# EAGLE board ArduHub (EAGLE 7.3.0)
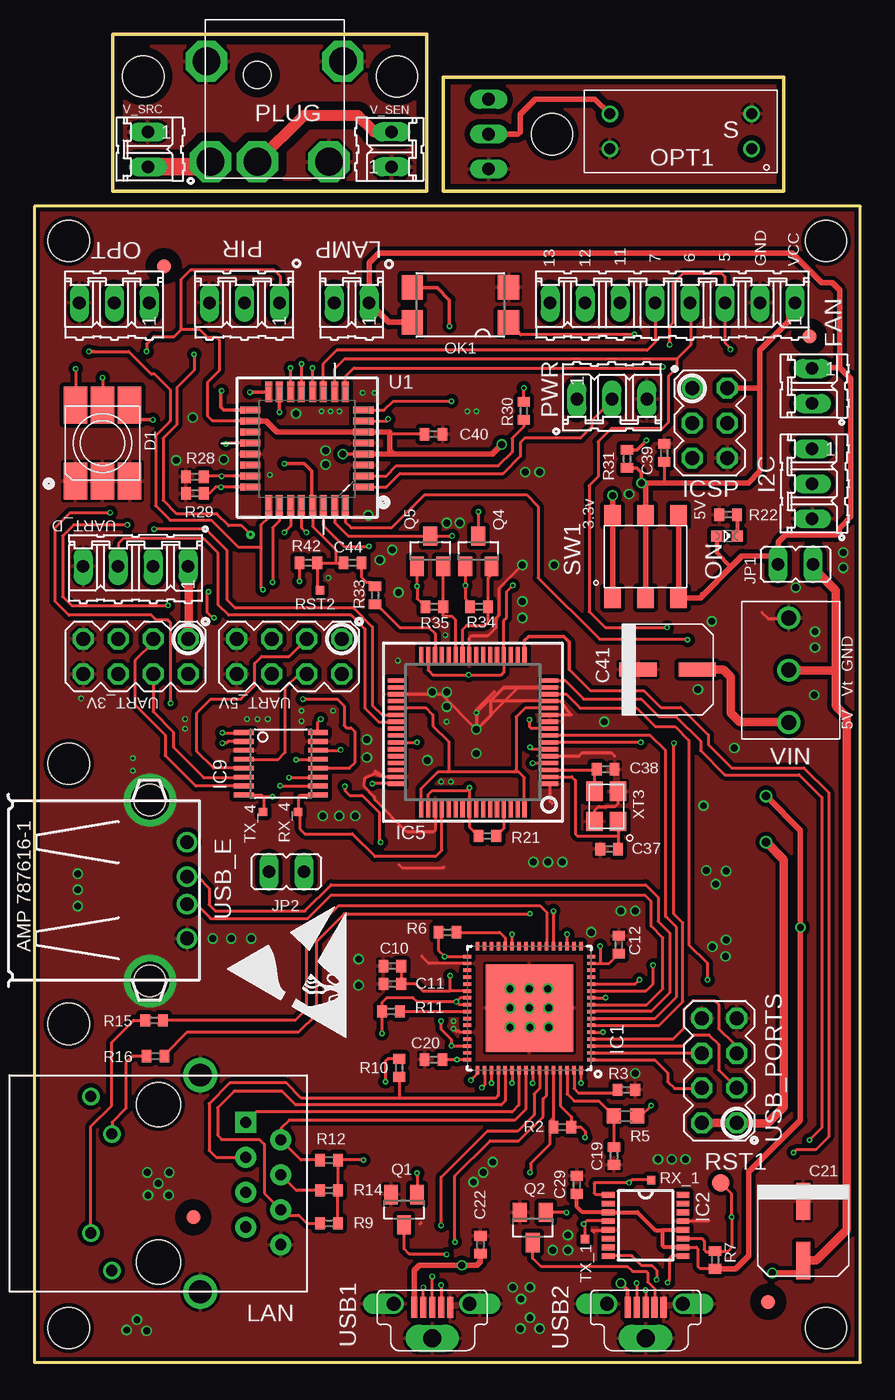
[diagram p3: board, top side]
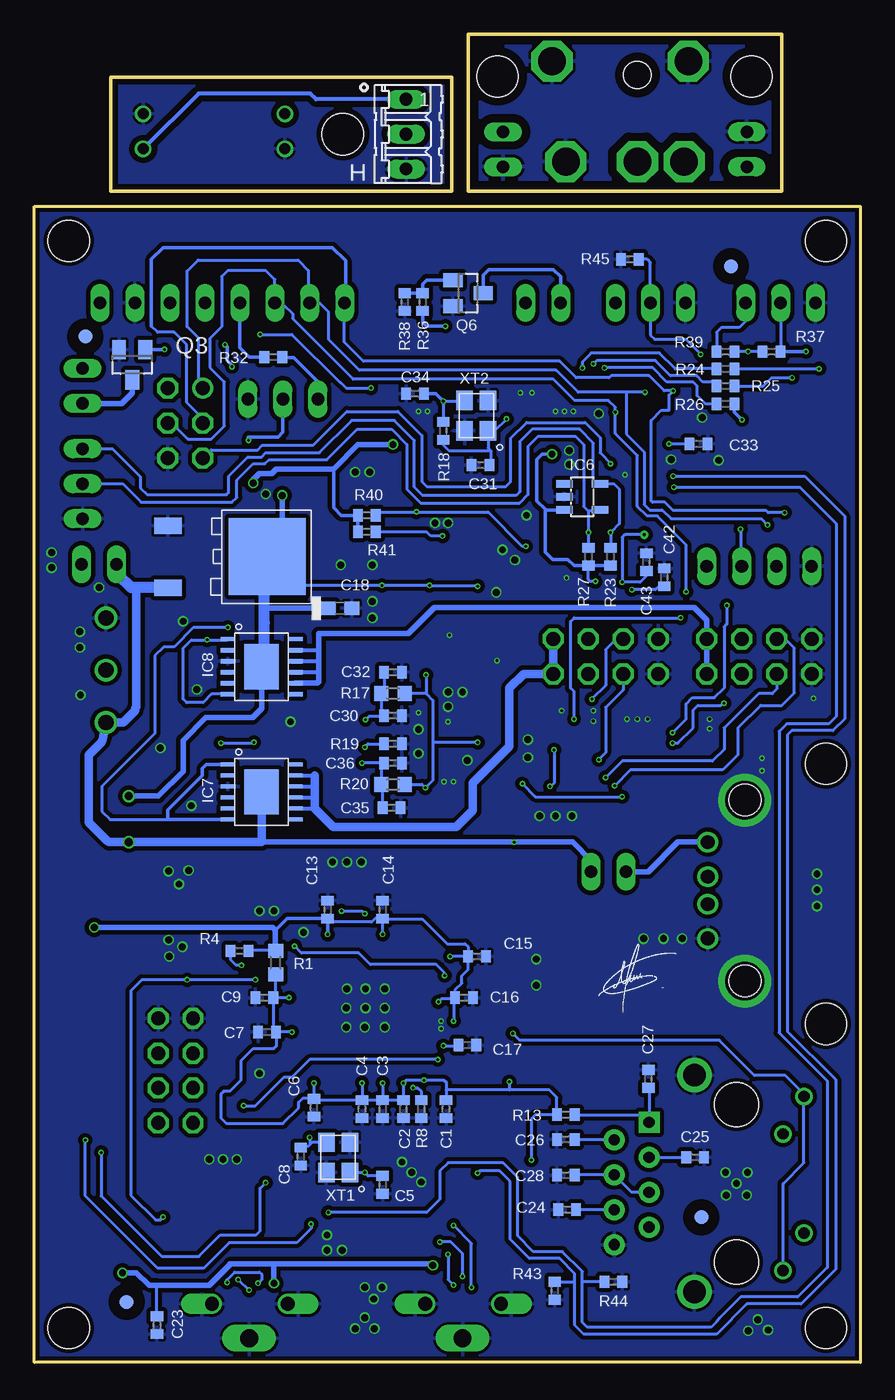
[diagram p4: board, bottom side, seen from below]

Size 60 x 96.5 mm. Coordinates in mm from the lower left corner, seen from the top.
Outline: 0,84 0,0 60,0 60,84 0,84
Outline: 5.7,96.5 5.7,85.1 28.5,85.1 28.5,96.5 5.7,96.5
Outline: 29.7,93.4 29.7,85.1 54.45,85.1 54.45,93.4 29.7,93.4
Copper layers (1*16): Top 0.035mm / dielectric 1.5mm / Bottom 0.035mm
Design rules "default *": minimum track width 0.2mm, minimum drill 0.2mm, track to track 0.2mm, track to pad 0.2mm, pad to pad 0.2mm, via to via 0.2mm, smd to smd 0.2mm, copper to edge 0.2mm, drill to drill 0.2mm, minimum pad ring 0.1mm, minimum via ring 0.1mm, stop-mask expansion 0.2mm, vias tented up to drill 0mil, thermal gap 0.2mm
Holes 3 mm at 2.5,24.6 2.5,2.5 2.5,43.5 57.5,2.5 2.5,81.5 57.5,81.5 37.6,89.25 7.9,93.45 26.35,93.45

## Footprints (pad centres in the part's own frame; a part is rotated, then mirrored left to right if it is on the bottom)
C0402 = smd 0.7 x 0.9: 1 -0.65,0; 2 0.65,0
C0603 = smd 1.1 x 1: 1 -0.85,0; 2 0.85,0
MVA_CAP_F55 = smd 1 x 2.7: P$+ 0,2.15; P$- 0,-2.15
PLCC-6 = smd 2.7 x 1.7: 1 -2.75,1.97; 2 -2.75,0.01; 3 -2.75,-1.97; 4 2.75,-1.97; 5 2.75,0; 6 2.75,1.97
02P = drill 0.914 long: 1 -1.27,0; 2 1.27,0
FIDUCIAL_TEST_2C = smd 1 x 1: P$1 0,0 | smd 1 x 1 bottom: P$2 0,0
03P = drill 0.914 long: 1 -2.54,0; 2 0,0; 3 2.54,0
QFN64 = smd 0.6 x 0.25: 1 -4.5,3.75; 2 -4.5,3.25; 3 -4.5,2.75; 4 -4.5,2.25; 5 -4.5,1.75; 6 -4.5,1.25; 7 -4.5,0.75; 8 -4.5,0.25; 9 -4.5,-0.25; 10 -4.5,-0.75; 11 -4.5,-1.25; 12 -4.5,-1.75; 13 -4.5,-2.25; 14 -4.5,-2.75; 15 -4.5,-3.25; 16 -4.5,-3.75; 33 4.5,-3.75; 34 4.5,-3.25; 35 4.5,-2.75; 36 4.5,-2.25; 37 4.5,-1.75; 38 4.5,-1.25; 39 4.5,-0.75; 40 4.5,-0.25; 41 4.5,0.25; 42 4.5,0.75; 43 4.5,1.25; 44 4.5,1.75; 45 4.5,2.25; 46 4.5,2.75; 47 4.5,3.25; 48 4.5,3.75 | smd 0.25 x 0.6: 17 -3.75,-4.5; 18 -3.25,-4.5; 19 -2.75,-4.5; 20 -2.25,-4.5; 21 -1.75,-4.5; 22 -1.25,-4.5; 23 -0.75,-4.5; 24 -0.25,-4.5; 25 0.25,-4.5; 26 0.75,-4.5; 27 1.25,-4.5; 28 1.75,-4.5; 29 2.25,-4.5; 30 2.75,-4.5; 31 3.25,-4.5; 32 3.75,-4.5; 49 3.75,4.5; 50 3.25,4.5; 51 2.75,4.5; 52 2.25,4.5; 53 1.75,4.5; 54 1.25,4.5; 55 0.75,4.5; 56 0.25,4.5; 57 -0.25,4.5; 58 -0.75,4.5; 59 -1.25,4.5; 60 -1.75,4.5; 61 -2.25,4.5; 62 -2.75,4.5; 63 -3.25,4.5; 64 -3.75,4.5 | smd 6.35 x 6.35: GND 0,0
SSOP16 = smd 0.914 x 0.406: 1 -2.718,2.223; 2 -2.718,1.587; 3 -2.718,0.953; 4 -2.718,0.318; 5 -2.718,-0.318; 6 -2.718,-0.953; 7 -2.718,-1.587; 8 -2.718,-2.223; 9 2.718,-2.223; 10 2.718,-1.587; 11 2.718,-0.953; 12 2.718,-0.318; 13 2.718,0.318; 14 2.718,0.953; 15 2.718,1.587; 16 2.718,2.223
TO_252_3 = smd 1.2 x 2: 1 -2.25,0; 3 2.25,0 | smd 5.6 x 5.6: TAB 0,7.2
LQFP64 = smd 0.3 x 1.2: 1 -3.75,-5.6; 2 -3.25,-5.6; 3 -2.75,-5.6; 4 -2.25,-5.6; 5 -1.75,-5.6; 6 -1.25,-5.6; 7 -0.75,-5.6; 8 -0.25,-5.6; 9 0.25,-5.6; 10 0.75,-5.6; 11 1.25,-5.6; 12 1.75,-5.6; 13 2.25,-5.6; 14 2.75,-5.6; 15 3.25,-5.6; 16 3.75,-5.6; 33 3.75,5.6; 34 3.25,5.6; 35 2.75,5.6; 36 2.25,5.6; 37 1.75,5.6; 38 1.25,5.6; 39 0.75,5.6; 40 0.25,5.6; 41 -0.25,5.6; 42 -0.75,5.6; 43 -1.25,5.6; 44 -1.75,5.6; 45 -2.25,5.6; 46 -2.75,5.6; 47 -3.25,5.6; 48 -3.75,5.6 | smd 1.2 x 0.3: 17 5.6,-3.75; 18 5.6,-3.25; 19 5.6,-2.75; 20 5.6,-2.25; 21 5.6,-1.75; 22 5.6,-1.25; 23 5.6,-0.75; 24 5.6,-0.25; 25 5.6,0.25; 26 5.6,0.75; 27 5.6,1.25; 28 5.6,1.75; 29 5.6,2.25; 30 5.6,2.75; 31 5.6,3.25; 32 5.6,3.75; 49 -5.6,3.75; 50 -5.6,3.25; 51 -5.6,2.75; 52 -5.6,2.25; 53 -5.6,1.75; 54 -5.6,1.25; 55 -5.6,0.75; 56 -5.6,0.25; 57 -5.6,-0.25; 58 -5.6,-0.75; 59 -5.6,-1.25; 60 -5.6,-1.75; 61 -5.6,-2.25; 62 -5.6,-2.75; 63 -5.6,-3.25; 64 -5.6,-3.75
SOT-23-5 = smd 0.55 x 1.2: 1 -0.95,-1.3; 2 0,-1.3; 3 0.95,-1.3; 4 0.95,1.3; 5 -0.95,1.3
POWERSSO-12 = smd 0.3 x 1.05: 1 -2,-2.45; 2 -1.2,-2.45; 3 -0.4,-2.45; 4 0.4,-2.45; 5 1.2,-2.45; 6 2,-2.45; 7 2,2.45; 8 1.2,2.45; 9 0.4,2.45; 10 -0.4,2.45; 11 -1.2,2.45; 12 -2,2.45 | smd 3.3 x 2.5: TAB 0,0
TSSOP-16 = smd 0.35 x 1.43: 1 -2.275,-2.7; 2 -1.625,-2.7; 3 -0.975,-2.7; 4 -0.325,-2.7; 5 0.325,-2.7; 6 0.975,-2.7; 7 1.625,-2.7; 8 2.275,-2.7; 9 2.275,2.7; 10 1.625,2.7; 11 0.975,2.7; 12 0.325,2.7; 13 -0.325,2.7; 14 -0.975,2.7; 15 -1.625,2.7; 16 -2.275,2.7
MA03-2 = drill 1.016: 1 -2.54,-1.27 | drill 1.016 octagon: 2 -2.54,1.27; 3 0,-1.27; 4 0,1.27; 5 2.54,-1.27; 6 2.54,1.27
JP1 = drill 0.914 long: 1 0,-1.27; 2 0,1.27
J0011D01BNL = drill 0.813 pad 1.524 square: 1 4.445,-6.35 | drill 0.813 pad 1.524: 2 3.175,-8.89; 3 1.905,-6.35; 4 0.635,-8.89; 5 -0.635,-6.35; 6 -1.905,-8.89; 7 -3.175,-6.35; 8 -4.445,-8.89 | drill 1.651 pad 2.159: CHS1 7.87,-3.05; CHS2 -7.87,-3.05 | drill 0.813 pad 1.27: G1 6.325,4.9; G2 3.6,3.38; Y1 -6.325,3.38; Y2 -3.6,4.9 | hole 3.2: 5.715,0; -5.715,0
SMD4 = smd 1.78 x 1.55: 1 -1.27,-3.5; 2 1.27,-3.5; 3 1.27,3.5; 4 -1.27,3.5
LED-603 = smd 0.8 x 0.8: A 0,-0.75; C 0,0.75
ITR9606 = drill 0.8: 1 5.15,-1.27; 2 5.15,1.28; 3 -5.15,1.27; 4 -5.15,-1.27
PJ051A = drill 2 octagon: 1 10.3,-3.4; 2 10.3,5.2; 3 10.3,0; P$1 3,6.2; P$2 3,-3.7 | hole 2: 4,0
SOT-23 = smd 1 x 1.4: 1 -0.95,-1.1; 2 0.95,-1.1; 3 0,1.1
R0603 = smd 1 x 1.1: 1 -0.85,0; 2 0.85,0
R0402 = smd 0.7 x 0.9: 1 -0.65,0; 2 0.65,0
B1,27 = smd 1.27 x 1.27: TP 0,0
TP06SQ = smd 0.6 x 0.6: TP 0,0
08P = drill 0.914 long: 1 -8.89,0; 2 -6.35,0; 3 -3.81,0; 4 -1.27,0; 5 1.27,0; 6 3.81,0; 7 6.35,0; 8 8.89,0
452403012014 = smd 1.2 x 1.5: 1 -2.4,-3; 2 0,-3; 3 2.4,-3; 4 -2.4,3; 5 0,3; 6 2.4,3
QFP80P900X900X120-32N = smd 1.473 x 0.508: 1 -4.115,2.794; 2 -4.115,2.007; 3 -4.115,1.194; 4 -4.115,0.406; 5 -4.115,-0.406; 6 -4.115,-1.194; 7 -4.115,-2.007; 8 -4.115,-2.794; 17 4.115,-2.794; 18 4.115,-2.007; 19 4.115,-1.194; 20 4.115,-0.406; 21 4.115,0.406; 22 4.115,1.194; 23 4.115,2.007; 24 4.115,2.794 | smd 0.508 x 1.473: 9 -2.794,-4.115; 10 -2.007,-4.115; 11 -1.194,-4.115; 12 -0.406,-4.115; 13 0.406,-4.115; 14 1.194,-4.115; 15 2.007,-4.115; 16 2.794,-4.115; 25 2.794,4.115; 26 2.007,4.115; 27 1.194,4.115; 28 0.406,4.115; 29 -0.406,4.115; 30 -1.194,4.115; 31 -2.007,4.115; 32 -2.794,4.115
MA04-2 = drill 1.016 octagon: 1 -3.81,-1.27; 2 -3.81,1.27; 3 -1.27,-1.27; 4 -1.27,1.27; 5 1.27,-1.27; 6 1.27,1.27; 7 3.81,-1.27; 8 3.81,1.27
04P = drill 0.914 long: 1 -3.81,0; 2 -1.27,0; 3 1.27,0; 4 3.81,0
1051330001 = smd 0.45 x 1.5: 1 -1.3,0.75; 2 -0.65,0.75; 3 0,0.75; 4 0.65,0.75; 5 1.3,0.75 | drill 1 pad 1.27 offset: P$1 -2.8,1; P$2 2.7,1 | drill 1.3 pad 1.422 long: P$3 0,-1.5
USB = drill 1: 1 -3.5,12.99; 2 -1,12.99; 3 1,12.99; 4 3.5,12.99 | hole 2.3: -6.57,10.28; 6.57,10.28
MOLEX_39357-3 = drill 1.1: P$1 -3.8,0; P$2 0,0; P$3 3.8,0
ABM8G = smd 1.4 x 1.2: 1 -1.1,-0.85; 2 1.1,-0.85; 3 1.1,0.85; 4 -1.1,0.85

## Placement (x,y rotation side)
C1  100nF  [C0402]  30.1,18.4 270 bottom
C2  100nF  [C0402]  33.2,18.4 270 bottom
C3  100nF  [C0402]  34.7,18.4 270 bottom
C4  100nF  [C0402]  36.2,18.4 270 bottom
C5  33pF  [C0402]  34.7,12.9 270 bottom
C6  100nF  [C0402]  39.7,18.5 270 bottom
C7  100nF  [C0402]  43.1,24 180 bottom
C8  33pF  [C0402]  40.65,14.95 270 bottom
C9  100nF  [C0402]  43.3,26.5 180 bottom
C10  4.7uF  [C0402]  26,28.8 180 top
C11  100nF  [C0402]  26,27.5 180 top
C12  100nF  [C0402]  42.45,30.35 90 top
C13  100nF  [C0402]  38.7,32.9 90 bottom
C14  100nF  [C0402]  34.7,32.9 90 bottom
C15  100nF  [C0402]  27.85,29.5 0 bottom
C16  100nF  [C0402]  28.8,26.5 0 bottom
C17  100nF  [C0402]  28.55,23.05 0 bottom
C18  100uF  [C0603]  37.8,54.8 0 bottom
C19  1uF  [C0402]  42.1,15 270 top
C20  100nF  [C0402]  29,22 180 top
C21  150uF  [MVA_CAP_F55]  55.85,9.55 180 top
C22  100nF  [C0402]  32.4,8.55 90 top
C23  100nF  [C0402]  51.1,2.7 270 bottom
C24  15pF  [C0402]  21.3,11.1 180 bottom
C25  15pF  [C0402]  12,14.9 0 bottom
C26  15pF  [C0402]  21.4,16.2 180 bottom
C27  15pF  [C0402]  15.4,20.6 90 bottom
C28  22nF  [C0402]  21.4,13.6 180 bottom
C29  100nF  [C0402]  39.4,12.9 90 top
C30  4.7uF  [C0402]  33.95,47 0 bottom
C31  22pF  [C0402]  27.6,65.2 180 bottom
C32  100nF  [C0402]  33.95,50.15 0 bottom
C33  100nF  [C0402]  11.75,66.75 180 bottom
C34  22pF  [C0402]  32.35,70.4 180 bottom
C35  4.7uF  [C0402]  34.05,40.3 0 bottom
C36  100nF  [C0402]  33.95,43.55 0 bottom
C37  27pF  [C0402]  41.75,37.3 180 top
C38  27pF  [C0402]  41.5,43.1 0 top
C39  1uF  [C0402]  45.75,66.1 90 top
C40  100nF  [C0402]  29,67.45 0 top
C41  150uF  [MVA_CAP_F55]  46,50.35 270 top
C42  100nF  [C0402]  14.25,57.05 90 bottom
C43  100nF  [C0402]  15.55,58.15 90 bottom
C44  100nF  [C0402]  23.1,58.1 180 top
D1  SLV6A-FKB  [PLCC-6]  4.95,66.8 90 top
FAN  [02P]  56.5,70.95 270 top
FIDUCIAL1  FIDU_2C  [FIDUCIAL_TEST_2C]  11.55,10.55 0 top
FIDUCIAL2  FIDU_2C  [FIDUCIAL_TEST_2C]  53.3,4.4 0 top
FIDUCIAL3  FIDU_2C  [FIDUCIAL_TEST_2C]  9.4,79.65 0 top
FIDUCIAL4  FIDU_2C  [FIDUCIAL_TEST_2C]  56.3,74.55 0 top
H  [03P]  33,89.25 270 bottom
I2C  [03P]  56.5,63.85 270 top
IC1  LAN9514  [QFN64]  35.95,25.74 180 top
IC2  FT230XS  [SSOP16]  44.4,9.95 0 top
IC4  AP1084D  [TO_252_3]  50.3,58.55 270 bottom
IC5  FT4232HL  [LQFP64]  31.85,45.8 90 top
IC6  TC74  [SOT-23-5]  20.2,62.9 270 bottom
IC7  VND7140AJ12TR  [POWERSSO-12]  43.5,41.45 270 bottom
IC8  VND7140AJ12TR  [POWERSSO-12]  43.5,50.55 270 bottom
IC9  MUX509IPWR  [TSSOP-16]  17.9,43.5 270 top
ICSP  [MA03-2]  49.05,68.25 270 top
JP1  [JP1]  55.3,58 90 top
JP2  [JP1]  18.3,35.65 270 top
LAMP  [02P]  23.05,77 180 top
LAN  J0011D01BNL  [J0011D01BNL]  9,13 90 top
OK1  LTV816S  [SMD4]  30.95,76.85 90 top
ON  [LED-603]  50.3,60.05 270 top
OPT  [03P]  5.8,77 180 top
OPT1  ITR9606  [ITR9606]  46.95,89.45 0 top
PIR  [03P]  15.25,77 180 top
PLUG  PJ051A  [PJ051A]  16.2,97.55 270 top
PWR  [03P]  41.95,70 0 top
Q1  [SOT-23]  26.85,11.1 180 top
Q2  [SOT-23]  36.2,9.8 180 top
Q3  [SOT-23]  52.9,72.5 180 bottom
Q4  [SOT-23]  32.25,58.95 0 top
Q5  [SOT-23]  28.75,58.95 0 top
Q6  [SOT-23]  28.5,77.7 270 bottom
R1  Ferrita  [R0603]  42.48,29.05 90 bottom
R2  1M  [R0402]  38.35,17.1 0 top
R3  12k  [R0402]  43,19.8 180 top
R4  1k  [R0402]  45.1,29.9 0 bottom
R5  Ferrita  [R0603]  42.94,17.9 0 top
R6  10k  [R0402]  30,31.25 0 top
R7  10k  [R0402]  49.45,7.45 270 top
R8  12.4k  [R0402]  31.9,18.4 90 bottom
R9  49.9  [R0402]  21.4,10.1 0 top
R10  49.9  [R0402]  26.5,21.4 90 top
R11  10k  [R0402]  25.9,25.5 180 top
R12  49.9  [R0402]  21.4,14.7 0 top
R13  49.9  [R0402]  21.4,18 180 bottom
R14  10  [R0402]  21.4,12.5 0 top
R15  1k  [R0402]  8.7,24.85 0 top
R16  1k  [R0402]  8.8,22.25 0 top
R17  Ferrita  [R0603]  33.95,48.6 0 bottom
R18  1M  [R0402]  30.3,67.7 90 bottom
R19  12k  [R0402]  33.95,44.95 180 bottom
R20  Ferrita  [R0603]  33.95,42 0 bottom
R21  10k  [R0402]  32.9,38.25 0 top
R22  1k  [R0402]  50.4,61.6 0 top
R23  10k  [R0402]  18.15,58.55 90 bottom
R24  1k  [R0402]  9.8,72.2 0 bottom
R25  1k  [R0402]  9.8,70.95 0 bottom
R26  1k  [R0402]  9.8,69.65 0 bottom
R27  10k  [R0402]  19.75,58.55 90 bottom
R28  10k  [R0402]  11.65,64.35 180 top
R29  10k  [R0402]  11.65,63.15 180 top
R30  1k  [R0402]  35.55,69.15 270 top
R31  10k  [R0402]  43.05,65.65 90 top
R32  220  [R0402]  42.65,73.05 180 bottom
R33  0  [R0402]  24.75,55.75 90 top
R34  10k  [R0402]  32.3,54.9 0 top
R35  10k  [R0402]  29.05,54.9 0 top
R36  220  [R0402]  31.8,77.05 270 bottom
R37  10k  [R0402]  6.45,73.45 0 bottom
R38  10k  [R0402]  33.1,77.05 90 bottom
R39  220  [R0402]  9.8,73.45 0 bottom
R40  10k  [R0402]  35.85,61.55 0 bottom
R41  10k  [R0402]  35.85,60.35 0 bottom
R42  10k  [R0402]  19.9,58.1 0 top
R43  10k  [R0402]  22.2,5.2 90 bottom
R44  10k  [R0402]  17.95,5.85 180 bottom
R45  10k  [R0402]  16.75,80.15 0 bottom
RST1  PTR1B1,27  [B1,27]  49.85,13.05 0 top
RST2  PTR1TP06SQ  [TP06SQ]  20.75,56.1 0 top
RX_1  PTR1TP06SQ  [TP06SQ]  44.8,13.25 0 top
RX_4  TPTP06SQ  [TP06SQ]  19.15,40 0 top
SL6  [08P]  46.35,77 180 top
SW1  452403012014  [452403012014]  44.4,58.55 0 top
TX_1  PTR1TP06SQ  [TP06SQ]  40,8.95 0 top
TX_4  TPTP06SQ  [TP06SQ]  16.6,40 0 top
U1  ATMEGA328P-AU  [QFP80P900X900X120-32N]  19.8,66.4 180 top
U$1  [FIRMA]  19.2,25.45 0 bottom
U$3  [STATIC]  22.75,23.5 90 top
UART_3V  [MA04-2]  7.35,51.3 180 top
UART_5V  [MA04-2]  18.5,51.3 180 top
UART_D  [04P]  7.35,57.85 180 top
USB1  1051330001  [1051330001]  28.9,3.25 0 top
USB2  1051330001  [1051330001]  44.4,3.25 0 top
USB_E  [USB]  -1.9,34.3 270 top
USB_PORTS  [MA04-2]  49.75,21.2 90 top
V_SEN  [02P]  25.95,88.15 90 top
V_SRC  [02P]  8.25,88.15 270 top
VIN  MOLEX_39357_3  [MOLEX_39357-3]  54.8,50.3 90 top
XT1  25MHz  [ABM8G]  37.94,14.89 90 bottom
XT2  ABM8G  [ABM8G]  27.9,68.8 90 bottom
XT3  ABM8G  [ABM8G]  41.55,40.4 90 top

## Tracks (layer width: path | path; a pad name or v marks a point on that pad's centre or on a via)
1V8CORE  (via drill 0.2)
  Top 0.2: C10.1 C11.1 27.7,27.5 28.21,26.99 30.19,26.99 | IC1.15 41.1,28.99 | 30.19,26.99 30.2,27 v30.2,28.1 | v41.1,30.25 41.1,28.99 | 41.1,28.99 41.74,28.99 C12.1 | IC1.38 30.19,26.99
  Bottom 0.2: v30.2,28.1 30.2,28.3 30.8,28.9 35.6,28.9 36.45,29.75 40.6,29.75 v41.1,30.25
3V3_A  (via drill 0.2)
  Top 0.2: IC1.51 v33.2,20.3 | IC1.54 v34.7,20.3 | IC1.57 v36.2,20.3 | IC1.5 v41.29,23.99 v41.3,24 | IC1.64 v39.7,20.3 | R9.2 R14.2 R12.2 v23.9,14.7 | R10.2 25.65,22.05 25.5,21.9 v25.5,20.4 | IC1.10 41.44,26.49 v41.5,26.5 | IC1.49 32.2,21 v31.7,20.5
  Bottom 0.2: v39.7,20.3 C6.1 | C9.1 42.48,26.53 R1.1 | v41.5,26.5 C9.1 | C7.1 42.45,22.95 42.6,22.8 44.1,22.8 45,21.9 45,20.5 45.8,19.7 46.25,19.7 46.45,19.5 46.45,17.75 46.05,17.35 41.95,17.35 40.8,18.5 40.8,18.9 40.5,19.2 39.75,19.2 C6.1 | C4.1 39.6,19.05 C6.1 | C3.1 C4.1 | C3.1 C2.1 v33.2,20.3 33,20.5 v31.7,20.5 30.25,20.5 30.1,20.4 30.1,19.8 | v36.2,20.3 C4.1 | v34.7,20.3 C3.1 | v41.3,24 C7.1 | 25.5,19.8 22.6,19.8 22.05,19.25 R13.2 23.6,18 23.9,17.7 v23.9,14.7 | 25.5,19.8 30.1,19.8 | 30.1,19.8 C1.1 | v25.5,20.4 25.5,19.8 | C9.1 42.65,24.2 C7.1
3V_UART
  Top 0.61: UART_D.1 11.16,56.26 11.2,56.25 11.2,53.88 UART_3V.1
  Bottom 0.305: IC8.9 39.45,50.15 39.35,50.25 | IC8.10 39.35,50.95 | IC8.11 39.35,51.75
  Bottom 0.406: IC8.8 39.45,49.35 39.35,49.45 39.35,50.25 39.35,50.95 39.35,51.75 39.35,52.95 32.85,52.95 30.95,54.85 12.05,54.85 11.16,53.96 UART_3V.1 UART_3V.2
5V_UART
  Bottom 0.305: IC7.11 39.65,42.65 | IC7.10 39.65,41.85 | IC7.9 39.7,41.05 39.65,41.1 | IC7.8 39.65,40.25
  Bottom 0.61: UART_5V.1 UART_5V.2 24.47,50.03 25.5,49 25.5,44.75 28.15,42.1 28.15,40.1 29.35,38.9 38.3,38.9 39.65,40.25 39.65,41.1 39.65,41.85 39.65,42.65
+3V3  (via drill 0.2, 0.5, 0.6)
  Top 0.2: IC1.33 v29.8,29.49 29.35,29.94 R6.1 | IC1.27 v34.7,31.1 | IC1.19 v38.7,31.1 | v25.25,23.9 R11.2 25.25,26.15 25.6,26.5 27.5,26.5 27.8,26.2 v30.65,26.2 | IC2.10 48.09,8.36 48.2,8.25 48.2,6.95 48.35,6.8 R7.2 | IC5.31 28.6,50.3 28.95,49.95 v31.55,49.95 33.9,49.95 34.1,50.15 IC5.20 34.1,53.9 34.3,54.1 34.3,56 v34.75,56.45 | IC5.42 v27.8,45.05 | R21.1 31.6,38.9 IC5.56 v31.6,41.75 31.4,41.55 28.9,41.55 28.6,41.25 IC5.50 | 31.65,57.5 Q4.1 v31.3,56.45 31.3,55.5 31.65,55.15 R34.1 | R35.1 27.8,55.5 v27.8,56.4 Q5.1 | IC1.40 30.86,25.99 v30.65,26.2 | IC1.39 30.94,26.49 v30.65,26.2 | v29.55,24.8 29.55,24.2 30.3,23.45 v30.3,23 IC1.46
  Top 0.305: 45.6,9.6 45.1,9.6 43.8,10.9 IC2.3 39.8,10.9 39.4,11.3 C29.1 | IC2.12 47.09,9.6 45.6,9.6 | IC2.10 45.74,8.36 45.65,8.45 45.65,9.55 45.6,9.6
  Top 0.406: R7.2 50.95,6.8 51.9,7.75 51.9,13.85 55.65,17.6 v55.65,31.6 55.65,38.65 v53.15,41.15 | v42,63 SW1.4 SW1.1
  Bottom 0.2: 29.66,22.99 C17.1 29.25,23 v30.3,23 | R1.2 42.48,30.2 | 29.55,26.4 C16.1 | 29.5,26.55 C16.1 | C14.1 34.65,32.2 31.8,32.2 30.02,30.43 28.73,30.43 28.5,30.2 C15.1 | v34.7,31.1 C14.1 | LAN.Y1 5.62,12.98 4.1,14.5 LAN.G1 4.1,19.5 5.45,20.85 7.7,20.85 10.25,23.4 24.75,23.4 v25.25,23.9 | C14.1 35.25,32.25 35.5,32 38.45,32 C13.1 | 29.55,26.4 v29.55,24.8 | R20.2 31.85,42 v31.6,41.75 31.05,42.3 31.05,45.1 | v31.55,49.95 31.55,48.6 | 31.55,48.6 R17.2 | 31.55,48.6 31.05,48.1 31.05,45.1 | v27.8,45.05 31,45.05 31.05,45.1 | v27.8,56.4 27.85,56.45 v31.3,56.45 v34.75,56.45 | 43.2,53.65 43.3,53.75 | v34.75,56.45 40.5,56.45 42.2,58.15 | 29.55,26.4 30.45,26.4 v30.65,26.2 | C16.1 29.45,27.05 28.95,27.55 28.95,28.1 28.5,28.55 C15.1 | 42.5,29.92 44.43,29.92 R4.2 | C15.1 v29.79,29.5 v29.8,29.49 | v34.75,56.45 34.7,56.45
  Bottom 0.254: 42.5,31.4 41.65,32.25 C13.1 v38.7,31.1
  Bottom 0.406: v53.15,41.15 51,41.15 49.2,42.95 49.2,45.2 47.55,46.85 44.15,46.85 43.5,47.5 IC8.TAB | v42,63 42,58.65 42.2,58.15 IC4.TAB | v55.65,31.6 42.7,31.6 42.5,31.4 42.5,29.92 R1.2 | C18.1 43.3,54.8
  Bottom 0.813: IC8.TAB 43.3,50.75 43.3,53.75 43.3,54.8 43.3,57.05 IC4.TAB
+5V  (via drill 0.2, 0.6)
  Top 0.2: 48.45,55.9 48.58,55.77 | IC9.14 22.23,44.48 v22.25,44.5 | v22.55,41.85 22.55,41.55 22.9,41.2 23.8,41.2 25.05,39.95 25.05,37.95 v25.15,37.8
  Top 0.305: ON.A 49.55,58.85 50.6,57.8
  Top 0.406: SW1.6 SW1.3 48.35,55.55 48.58,55.77 50.6,57.8 51.4,58.6 53.93,58.6 JP1.2 54.05,58.62 54.05,59.6 54.55,60.1 58.2,60.1 58.45,60.35 58.45,60.6 59.3,61.45 59.3,71.5 58.5,72.3 58.35,72.3 | OK1.4 25.74,75.58 LAMP.1 24.32,79.92 25,80.6 55.05,80.6 57.2,78.45 57.95,78.45 58.5,77.9 58.5,72.45 58.35,72.3 | 58.35,72.3 56.58,72.3 FAN.1
  Top 0.61: v53.15,37.8 54.45,36.5 54.45,18.55 53.25,17.35 51.06,17.35 USB_PORTS.1 USB_PORTS.2 | C41.P$+ 50.05,50.35 50.6,49.8 50.6,47.2 51.25,46.55 54.75,46.55 VIN.P$1
  Bottom 0.2: v22.25,44.5 22.25,42.1 22.5,41.85 v22.55,41.85
  Bottom 0.406: 43.5,37.8 v25.15,37.8 20.9,37.8 19.55,36.45 19.55,35.67 JP2.2
  Bottom 0.61: IC7.TAB 43.5,37.8 v53.15,37.8 54.47,37.8 arc45 54.69,37.89 56.05,39.25 56.05,44.15 55.14,45.06 arc-45 55.05,45.28 VIN.P$1 53.55,46.5 52.69,47.36 52.69,47.51 arc-45 52.6,47.73 52.6,56.15 53.89,57.19 arc45 53.98,57.41 JP1.2
  Bottom 0.813: IC4.3 52.95,56.3 53.89,57.19
+5V/1  (via drill 0.5)
  Top 0.305: USB2.1 43.1,5.25 v42.6,5.75
  Top 0.406: C22.1 32.4,7.3 32.15,7.05 v31.05,7.05 27.95,7.05 27.6,6.7 USB1.1 | v53.6,6.5 55.9,6.5 55.95,6.55 55.95,7.3 C21.P$+
  Top 0.61: VIN.P$2 55.42,50.35 arc-45 55.64,50.26 57.98,50.26 arc45 58.2,50.35 | C21.P$+ 56.8,7.4 58.91,9.51 arc45 59,9.73 59,46.9 58.29,47.61 arc-45 58.2,47.83 58.2,50.35 | 58.2,50.35 58.2,56.1 56.64,57.66 arc-45 56.55,57.88 56.55,58.48 arc45 JP1.1
  Bottom 0.2: C23.1 51.1,5.5 51.15,5.6
  Bottom 0.305: 42.6,6.95 42.45,7.15
  Bottom 0.406: v31.05,7.05 31.2,7.05 31.2,7.15 42.45,7.15 45.8,7.15 45.8,7.1 47.3,5.6 51.15,5.6 51.65,5.6 52.6,6.5 v53.6,6.5 | v42.6,5.75 42.6,6.95
A0  (via drill 0.2)
  Top 0.2: U1.23 v13.61,64.39 | v13.61,64.39 v13.6,64.4 | v27.8,13.75 Q1.1 | v13.61,64.39 12.14,64.39 12.65,64.35 R28.1
  Bottom 0.2: v13.6,64.4 4.05,64.4 1.15,61.5 1.15,46.75 2,45.9 5,45.9 5.3,45.6 5.3,24.05 1.8,20.55 1.8,6.75 4.3,4.25 8.25,4.25 10.45,2.05 20.1,2.05 20.75,2.7 20.75,5.85 | 20.75,5.85 20.75,6.45 21.85,7.55 24.05,7.55 25.45,8.95 25.45,13.15 26.2,13.9 27.65,13.9 v27.8,13.75 | R43.2 20.75,5.85
A1  (via drill 0.2)
  Top 0.2: U1.24 14.11,63.61 | 14.11,63.61 v13.55,63.6 | v38.65,10.9 Q2.1 | 14.11,63.61 13.16,63.61 12.7,63.15 R29.1
  Bottom 0.2: v13.55,63.6 4.4,63.6 1.75,60.95 1.75,46.95 2.3,46.4 5.35,46.4 5.9,45.85 5.9,23.95 2.4,20.45 2.4,6.9 4.55,4.75 8.7,4.75 10.2,3.25 10.4,3 10.85,2.55 19.85,2.55 20.2,2.9 20.2,5.85 | 20.2,5.85 20.2,6.6 21.65,8.05 23.75,8.05 24.9,9.2 24.9,13.45 25.95,14.5 29.95,14.5 30.55,13.9 30.55,11.85 31.5,10.9 v38.65,10.9 | R44.2 20.2,5.85
A2  (via drill 0.2)
  Top 0.2: U1.25 17.01,61.41 16.45,60.85 16.45,59.15 | 16.45,59.15 16.45,56.3 v16.6,56.15 | 4.35,73.45 6.85,73.45 8.5,71.8 8.75,71.8 9.85,70.7 9.85,68.4 8.8,67.35 8.8,62.25 9.85,61.2 12.85,61.2 14.8,59.25 16.35,59.25 16.45,59.15
  Top 0.254: v3.95,73.45 4.35,73.45
  Bottom 0.2: C42.1 14.6,56.4 14.9,56.15 v16.6,56.15 | OPT.2 R37.2
  Bottom 0.254: R37.2 v3.95,73.45
A3  (via drill 0.2, 0.2 pad 0.61)
  Top 0.2: U1.26 17.79,61.14 17.3,60.65 v17.3,56.7 | v11.6,73.25 11.6,72.1 10.35,70.85 10.35,68.15 9.35,67.15 9.35,62.65 10.35,61.65 13.25,61.65 14.1,60.8 15.05,60.8 v15.7,60.15
  Bottom 0.2: v17.3,56.7 17.3,56.65 | C43.1 15.55,57.15 16,56.7 v17.3,56.7 | v11.6,73.25 12.7,74.35 14.95,74.35 15.25,74.65 PIR.2 15.25,79.9 15.5,80.15 R45.2 | v15.7,60.15 17.1,60.15 17.3,59.95 v17.3,56.7
D2  (via drill 0.2)
  Top 0.2: U1.32 22.59,61.06 23,60.65 25.95,60.65 28.35,63.05 35.75,63.05 36.6,62.2 36.6,57 41.05,52.55 47.4,52.55 v47.45,52.5
  Bottom 0.2: IC8.1 46,52.5 v47.45,52.5 48.6,52.5 49.2,51.9 49.2,48.2 48.95,47.95 47.75,47.95 47.15,48.55 IC8.6
D3  (via drill 0.2)
  Top 0.2: U1.1 25.56,63.61 26.55,64.6 34.05,64.6 35.3,65.85 35.3,66.85 35.65,67.2 39.7,67.2 40.5,68 40.5,68.45 41.95,69.9
  Top 0.254: PWR.2 41.95,69.9 | R31.2 43.75,66.3 v44.45,67
  Bottom 0.254: v44.45,67 44.45,67.25 42.3,67.25 41.95,67.6 PWR.2
D4
  Top 0.2: U1.2 25.54,64.39 26.3,65.15 33.7,65.15 34.7,66.15 34.7,67.15 35.55,68 R30.2
  Top 0.254: 35.5,68.45 R30.2
D5  (via drill 0.2)
  Top 0.2: U1.9 22.59,71.64 23.2,72.25 45.55,72.25 v45.65,72.35 | 50.2,76.95 50.2,74.05 50.55,73.7 | 50.2,76.95 50.2,76.99 | v46.15,73.95 46.15,75.3 46.4,75.55 46.4,78.4 47.15,79.15 49.9,79.15 50.15,78.9 SL6.3 50.2,76.95
  Top 0.254: v50.55,73.6 50.55,73.7
  Bottom 0.254: Q3.1 v50.55,73.6 | v45.65,72.35 45.65,72.45 46,72.8 46,73.8 v46.15,73.95
D6  (via drill 0.2)
  Top 0.2: U1.10 21.81,72.21 22.5,72.9 46.65,72.9 | 46.65,72.9 47.7,73.95 47.7,76.95 47.67,76.95 SL6.4 | 46.65,72.9 46.65,72.25 46.05,71.65 46.05,68.3 45.6,67.85 41.9,67.85 40.95,66.9 40.95,64.35 40.3,63.7 40.3,54.55 41.45,53.4 v45.95,53.4
  Bottom 0.2: v45.95,53.4 48.45,53.4 49.85,52 50.6,52 51.25,51.35 51.25,45.7 55.1,41.85 55.1,40.05 54.5,39.45 50.3,39.45
  Bottom 0.254: IC7.6 50.3,39.45 50.3,40.15 47.8,42.65 47.8,43.15 47.5,43.45 IC7.1
D7
  Top 0.2: U1.11 20.99,72.59 21.95,73.55 44.5,73.55 45.1,74.15 45.1,76.99 SL6.5
  Bottom 0.254: SL6.5 45.08,73.73 44.4,73.05 R32.2
D8  (via drill 0.2)
  Top 0.2: v20.2,72.25 20.2,70.52 U1.12
  Bottom 0.2: R24.1 13.45,72.2 14.6,73.35 19.55,73.35 20.2,72.7 v20.2,72.25
D9  (via drill 0.2)
  Top 0.2: v19.4,72.55 19.4,70.52 U1.13
  Bottom 0.2: v19.4,72.55 19.15,72.8 14.9,72.8 13.8,71.7 11.9,71.7 11.45,71.25 10.55,71.25 10.45,71.15 R25.1
D10  (via drill 0.2)
  Top 0.2: v18.6,72.25 18.6,70.52 U1.14
  Bottom 0.2: v18.6,72.25 18.55,72.3 15.1,72.3 14.05,71.25 12.15,71.25 11.85,70.95 11.85,70.25 11.25,69.65 R26.1
D11  (via drill 0.2)
  Top 0.2: IC9.16 20.6,46.55 v20.8,46.75 | v13.05,54.1 12.95,54.1 12.55,54.5 12.55,55.9 v12.65,56
  Top 0.254: U1.15 17.79,69.26 v17.8,69.05
  Bottom 0.2: ICSP.4 49.97,68.22 48.85,67.1 47.15,67.1 46.2,68.05 46.2,71.25 47.25,72.3 47.25,74.4 46.4,75.25 46.4,78.9 45.95,79.35 43.2,79.35 42.54,78.69 SL6.6 42.45,76.91 42.45,76.88 41.93,76.88 41.25,76.2 41.25,75.85 36.85,71.45 22.3,71.45 20.75,69.9 18.3,69.9 17.8,69.4 v17.8,69.05 17.8,67.5 16.2,65.9 16.2,62.2 15.5,61.5 14.75,61.5 12.65,59.4 v12.65,56 | v20.8,46.75 20.8,48.75 21.05,49 21.05,53.85 20.8,54.1 v13.05,54.1
D12  (via drill 0.2)
  Top 0.2: v6.75,60.85 2.85,60.85 2.05,60.05 2.05,55.65 2.7,55 v9.7,55 | v13.65,45.75 15.18,45.75 IC9.1
  Top 0.254: U1.16 15.66,70.52 v15.65,70.5
  Bottom 0.2: 40.1,77.1 40.1,79.35 40.85,80.1 48.1,80.1 48.9,79.3 48.9,75.25 48.08,74.43 48.05,71.4 | ICSP.1 47.78,71.13 | v6.75,60.85 7.2,61.3 13.75,61.3 14.4,61.95 15.3,61.95 15.7,62.35 15.7,66.15 17.01,67.46 U1.16 16.99,70.5 v15.65,70.5 20.5,70.5 22.1,72.1 36.4,72.1 38.65,74.35 38.65,76.35 39.28,76.98 39.95,76.98 39.97,77 SL6.7 | v9.7,55 9.7,53.65 9.9,53.45 9.9,49 10.6,48.3 12.2,48.3 12.65,47.85 12.65,46.75 v13.65,45.75
  Bottom 0.254: 40.1,77.1 SL6.7 | 40.05,76.98 39.95,76.98 | 47.78,71.13 48.05,71.4
D13  (via drill 0.2)
  Top 0.2: IC9.2 14.07,45.12 13.95,45 v13.65,45 | v9.9,47.9 9.9,53.75 9.7,53.95 8.85,53.95 8.5,54.3 2.5,54.3 1.5,55.3 1.5,60.65 2.6,61.75 v5.5,61.75
  Top 0.254: U1.17 13.76,69.19 13.55,69.4 13.55,70.55 v13.6,70.6
  Bottom 0.2: 51.5,75.3 51.05,74.85 49.85,74.85 48.95,73.95 48.95,69.75 47.78,68.58 | v13.65,45 13.25,45 12.15,46.1 12.15,47.4 11.8,47.75 10.15,47.75 v9.9,47.9 | v5.5,61.75 6.7,61.75 6.85,61.9 13.6,61.9 14.2,62.5 15.1,62.5 15.2,62.6 15.2,68.44 14.45,69.19 13.9,69.19 13.9,70.3 v13.6,70.6 14.25,70.6 15.35,71.7 18.1,71.7 18.25,71.55 20.65,71.55 21.85,72.75 36.1,72.75 37.5,74.15 37.5,76.99 37.49,77 SL6.8
  Bottom 0.254: 51.5,75.3 51.5,80.15 50.65,81 38.35,81 37.4,80.05 37.4,77.06 SL6.8 | ICSP.3 47.78,68.58
DTR_ARD
  Top 0.2: IC5.30 29.1,52.95 28.65,53.4 26.55,53.4 24.85,55.1 R33.1
ETH_PLL  (via drill 0.2)
  Top 0.2: C20.1 v30.7,22 IC1.48 | R5.2 44.06,17.91 v44.8,18.65
  Bottom 0.2: v44.8,18.65 43.95,18.65 41.9,20.7 41.3,20.7 40,22 v30.7,22
FTDI_VCORE
  Top 0.2: IC5.49 28.1,41.7 29.3,42.9 30.05,42.9 | IC5.37 28.45,47.55 28.95,47.05 28.95,46.25 30.1,45.1 30.1,42.95 30.05,42.9 | IC5.64 35.6,42.5 35.2,42.9 34.85,42.9 | 34.85,42.9 30.05,42.9 | IC5.12 35.65,47.55 35,46.9 35,43.05 34.85,42.9
GND  (via drill 0.2, 0.5, 2.8 pad 0.25)
  Top 0.2: IC1.34 28.66,28.99 28.15,29.5 | 28.1,10.15 28,10.05 | 40.65,9.45 40.5,9.6 41.65,9.6 IC2.5 | IC2.13 48.97,10.27 49,10.3 | XT3.4 40.7,40.1 41,40.4 42.2,40.4 42.4,40.6 XT3.2 | 25.4,42.55 24.75,42.95 | 39.4,44.05 IC5.5 39.55,44.05 39.8,44.3 41.9,44.3 42.15,44.05 | IC5.1 37.45,40.75 37.6,40.6 | 29.75,36 29.65,35.9 26.75,35.9 26.5,36.15 | 25.4,42.55 24.7,42.8 24,42.45 23.95,41.85 24.7,41.1 24.75,40.85 27.05,38.55 29,38.55 29.1,38.65 IC5.51 | IC5.47 25.4,42.55 | IC5.35 29.55,48.55 v32.1,46 35.15,49.05 IC5.15 | 52.85,54.5 53.3,54.05 54.95,54.05 VIN.P$3 | v32.1,47.2 32.95,48.05 IC5.13 38.25,48.05 39,47.05 IC5.11 | IC1.44 30.91,23.99 30.85,24.05 30.65,24.05 v30.45,24.25 | IC5.25 31.6,52.65 31.75,52.8 32.95,52.8 33.55,53.4 33.55,54.1 33.75,54.3 33.75,56.25 v35.45,57.95
  Top 0.254: IC5.15 34.1,49.05 33.15,48.1 33.15,47 32.15,46 32.15,47.45 33.4,48.7
  other vias: 34.55,27.15 35.95,27.15 37.3,27.15 37.35,25.75 37.35,24.35 36,24.35 35.95,25.75 34.55,25.75 34.55,24.35 43.65,21 50.25,30.7 50.2,29.5 49.25,30.2 6.7,2.35 7.45,3.1 8.15,2.3 31.9,13.1 32.6,13.8 33.3,14.55 35.3,2.45 36,3.25 36.7,2.45 50.25,35.7 49.5,34.75 48.8,35.75 15.75,30.8 12.95,30.8 14.3,30.8 32.1,44.25 41.4,46.55 43.65,32.8 42.6,32.8 36.25,36.35 37.3,36.35 38.35,36.35 24.15,43.95 24.15,45.25 36,5.45 35.35,4.6 34.75,5.45 45.3,14.75 46.3,14.75 47.3,14.75 56.7,51.95 56.65,48.5 56.7,53.1 55.3,56.3 9.75,12.15 9,13 8.2,13.8 9.8,13.8 8.25,12.15 38.75,8.15 38.75,9.25 37.65,8.15 19,68.95 26.45,55.95 26,59.05 25.1,58.3 29.95,61 30.9,61 37.75,57.95 35.45,55.3 21.15,66.25 21.15,65.25 24.25,61.55 36.7,64.7 35.65,64.7 28.9,48.7 29.95,48.7 29.95,47.65 28.55,43.75 11.5,68.65 13.75,65.6 10.3,65.55 58.75,58.85 58.75,57.75 40.45,31.25 20.85,69.1 21.5,69.1 22.15,69.1 16.2,46.75 16.95,46.75 29.95,46.55 29.55,42.2 29.85,52.85 49.2,53.85 48.2,48.9 23.55,29.3 23.55,27.4 3.15,35.5 3.15,34.35 3.15,33.15 48.6,40.45 19.4,47.35 19.4,46.6 7.15,43.9 7.15,43 21.35,57 17.1,64.5 15.45,46.75 3.4,48.25 23.85,70.45 24.7,70.45 30.25,42.2 20.95,39.7 22.15,39.7 23.3,39.7 35.45,54.1 43.2,63.1 30.45,24.8 31.45,69.1 32.1,69.1 8.4,40.85 8.4,27.7 21.7,47.35 10.95,46.75 10.95,46.05 50.85,44.65 26.4,51
  pour Top (isolate 0.305): -0.45,84.1 0.15,-0.75 60.15,-0.35 61.15,84.1
  pour Bottom (isolate 0.305): -0.25,84.25 -0.9,-0.35 60.35,0.25 61,84.25
GND1
  pour Top (isolate 0.61): 4.9,85 28.7,85 28.7,96.35 4.9,96.4
  pour Bottom (isolate 0.61): 4.95,95.9 5.7,85.05 28.6,85.05 28.6,96.25 5.85,96.25
GND2
  pour Bottom (isolate 0.406): 29.65,93.45 29.65,85 54.7,85 54.7,93.4 29.7,93.4
  pour Top (isolate 0.406): 29.8,93.4 29.8,85.15 54.4,85.15 54.4,93.4
GRN
  Top 0.2: 5.6,16.62 LAN.G2 5.65,16.63 5.65,17.45 6.65,18.45 6.65,21.8 7.1,22.25 R16.1
N$1  (via drill 0.2)
  Top 0.2: IC1.60 R2.1 37.45,17.1 | 37.7,17.85 37.7,17.75 37.45,17.5 37.45,17.1 | 37.45,17.1 37.45,15.85 36.05,14.45 36.05,13.85 v36,13.8
  Bottom 0.2: XT1.1 v36.01,13.79 v36,13.8 35.75,13.55 C5.1
N$2  (via drill 0.2)
  Top 0.2: IC1.61 38.2,18.65 39,17.85 R2.2 39.7,17.1 40,16.8 v40,16.35
  Bottom 0.2: XT1.3 39.8,16 40,15.8 | v40,16.35 40,15.8 | 40,15.8 40.1,15.7 40.55,15.7 C8.1
N$3  (via drill 0.2)
  Top 0.2: IC1.50 32.7,20.15 v32.5,19.95
  Bottom 0.2: v32.5,19.95 32.2,19.95 31.9,19.7 R8.2
N$4
  Top 0.2: IC1.63 39.2,19.9 39.5,19.6 42.15,19.6 R3.2
N$5
  Top 0.2: R14.1 19.02,12.5 LAN.4
  Bottom 0.2: LAN.4 20.71,13.63 C28.1 | LAN.4 17.89,13.79 17.9,13.8 | LAN.5 16.62,12.37 LAN.4
N$6
  Top 0.2: R11.1 IC1.41
N$7  (via drill 0.2)
  Top 0.2: v37.7,32.8 IC1.21 | 36.1,32.6 v36,32.6 22.5,32.6 20.5,30.6 20.5,25.3 19.2,24 11.1,24 9.45,22.35 R16.2
  Bottom 0.2: v37.7,32.8 36.2,32.8 v36,32.6
N$8
  Top 0.2: IC1.22 37.2,32.7 36.7,33.2 22.1,33.2 19.8,30.9 19.8,25.7 19,24.9 9.6,24.9 R15.2
N$9  (via drill 0.2)
  Top 0.2: Q1.3 26.85,8.25 27.2,7.9 29.9,7.9 v29.95,7.85 | v29.55,5.6 USB1.4
  Bottom 0.2: v29.95,7.85 29.95,6 v29.55,5.6
N$10
  Top 0.2: R6.2 33.8,31.25 34.2,30.85 IC1.28
N$11
  Top 0.2: IC5.61 34.1,38.8 R21.2
N$12  (via drill 0.2)
  Top 0.2: IC5.6 36.15,44.55 v36,44.7
  Bottom 0.2: v36,44.7 35.75,44.95 R19.2
N$13
  Top 0.2: IC5.2 39.05,42.55 39.3,42.3 39.3,38.4 39.45,38.25 42.35,38.25 42.4,38.2 | XT3.1 42.4,38.2 | 42.4,38.2 C37.1
N$14
  Top 0.2: IC5.3 40.8,43.05 C38.1 40.7,42.95 XT3.3
N$15
  Bottom 0.305: H.1 39.54,91.79 39.95,92.2 48.08,92.2 OPT1.1
N$16
  Top 0.406: H.2 35.1,89.25 35.3,89.4 35.3,90.7 36.4,91.8 40.72,91.8 OPT1.3
N$17  (via drill 0.2)
  Top 0.2: U1.20 13.96,66.81 v13.9,66.75
  Bottom 0.2: v13.9,66.75 C33.2
N$18  (via drill 0.2)
  Top 0.2: v3,72.2 3,68.52 D1.6
  Bottom 0.2: R24.2 v3,72.2
N$19  (via drill 0.2)
  Top 0.2: v4.95,71.55 D1.5
  Bottom 0.2: R25.2 7.05,70.95 6.45,71.55 v4.95,71.55
N$20  (via drill 0.2)
  Top 0.254: v8.6,68.5 6.92,68.5 D1.4
  Bottom 0.254: R26.2 9.15,69.05 v8.6,68.5
N$21
  Top 0.2: Q2.3 36.2,7.55 36.8,6.95 43.1,6.95 43.45,6.6 44.45,6.6 44.55,6.5 44.55,5.85 45.05,5.35 USB2.4
N$22
  Top 0.813: V_SEN.2 24.68,89.42 23.5,90.6 19.55,90.6 PLUG.3
N$23
  Top 0.305: R22.2 ON.C
N$24
  Bottom 0.254: LAMP.2 21.78,78.88 22.3,79.4 27,79.4 27.4,79 Q6.3
N$25
  Bottom 0.2: OPT.1 8.34,75.66 8.8,75.2 10.1,75.2 10.45,74.85 R39.1
N$26
  Bottom 0.254: Q6.1 31.5,78.65 31.8,78.35 R36.1 R38.2
N$27  (via drill 0.2)
  Top 0.254: v30.15,75.3 30.15,77.2 29.25,78.1 27.47,78.1 OK1.3
  Bottom 0.254: R36.2 31.8,75.55 31.55,75.3 v30.15,75.3
N$28  (via drill 0.2)
  Top 0.2: R30.1 v35.55,70.8 | v43.6,74.7 35.33,74.7
  Top 0.254: 35.33,74.7 OK1.1
  Bottom 0.2: v43.6,74.7 41.3,74.7 37.8,71.2 37.75,71.2 37.35,70.8 v35.55,70.8
N$29
  Bottom 0.406: FAN.2 53.67,69.68 52.9,70.45 Q3.3
N$30
  Bottom 0.254: PWR.1 39.41,71.26 41.15,73 41.95,73 R32.1
N$31
  Top 1.27: V_SRC.2 12.43,86.88 PLUG.1
N$32
  Top 0.2: C44.1 23.75,57.05 24.1,56.7 24.45,56.7 R33.2
N$33  (via drill 0.2)
  Top 0.2: IC1.11 40.64,26.99 40.7,27 44.44,27 44.94,27.5 44.95,27.5 v44.95,28.85
  Bottom 0.2: v44.95,28.85 45.35,28.85 45.75,29.25 R4.1
N$34
  Bottom 0.406: USB_E.1 13.25,37.8 15.4,35.65 JP2.1
RST1  (via drill 0.2)
  Top 0.2: IC2.11 48.5,9 48.65,8.85 48.65,8.2 48.8,8.05 49.4,8.05 R7.1 49.5,8.05 50.35,8.05 50.65,8.35 v50.65,10.55 50.65,12.25 RST1.TP | IC5.14 38.65,48.55 39.65,47.55 43.75,47.55 45.1,46.2 46.55,46.2 47.55,45.2 47.55,30.35 48.9,29 v48.9,27.8 | IC1.12 43.64,27.49 v43.95,27.8
  Bottom 0.2: v43.95,27.8 v48.9,27.8 52.2,27.8 53,27 53,12.15 51.2,10.35 50.85,10.35 v50.65,10.55
RST2  (via drill 0.2)
  Top 0.2: U1.29 20.21,60.74 21.9,59.05 21.9,58.1 | 21.9,58.1 C44.2 | 21.9,58.1 R42.2 20.55,56.3 RST2.TP
  Top 0.254: v18.15,65.3 19.6,65.3 20.15,64.75 20.15,62.34 U1.29
  Bottom 0.2: 47.15,66.3 43.79,66.31 43.45,66.65 39.75,66.65 37.3,69.1 33.6,69.1 31.85,67.35 31.85,64 31.5,63.65 25.75,63.65 25.4,64 25.4,67.15 24.25,68.3 20,68.3 18.9,67.2 18.9,66.1 v18.15,65.3
  Bottom 0.254: 18.2,65.35 v18.15,65.3 | ICSP.5 47.74,65.71 47.15,66.3
RX3
  Top 0.2: IC5.39 25,46.55 24,47.55 24,53.3 23,54.3 14.1,54.3 13.35,55.05 13.35,58.8 12.3,59.85 6.45,59.85 6.1,59.5 6.1,57.87 UART_D.3
RX_ARD
  Top 0.2: IC5.27 30.6,53.95 30.35,54.2 29.75,54.2 29.7,54.25 R35.2 Q5.2
RX_D
  Top 0.2: IC5.52 29.6,37.2 29.15,36.75 24.75,36.75 23.1,38.4 19.65,38.4 19.27,38.77 19.27,39.88 RX_4.TP 19.15,41.05 19.32,41.23 IC9.9
RX_MCU  (via drill 0.2)
  Top 0.2: U1.30 20.99,60.81 22.5,59.3 v24.3,59.3 | v32.25,61.8 Q4.3
  Bottom 0.2: R40.2 35.2,61.8 v32.25,61.8 27.05,61.8 24.55,59.3 v24.3,59.3
RX_T  (via drill 0.2)
  Top 0.2: IC2.4 40.12,10.27 v39.9,10.05 40,9.95 TX_1.TP | v56.3,16.15 57.2,17.05 57.2,41.05 55.55,42.7 50.15,42.7 48.4,44.45 48.4,45.15 46.6,46.95 45.35,46.95 44.1,48.2 39.9,48.2 38.55,49.55 IC5.16
  Bottom 0.2: v56.3,16.15 56.3,12.1 51.05,6.85 47.7,6.85 45.85,8.7 40.95,8.7 39.9,9.75 v39.9,10.05
RXN
  Top 0.2: IC1.53 34.2,19 33.9,18.7 19,18.7 18,19.7 14.5,19.7 13.3,18.5 13.3,16.5 13.6,16.2 16.35,16.2 16.7,15.85 16.7,12.29 LAN.6 18.29,10.7 19.2,10.7 19.8,10.1 R9.1
  Bottom 0.2: LAN.6 C24.1
RXP
  Top 0.2: IC1.52 33.7,19.4 33.5,19.2 26.5,19.2 | 26.5,19.2 19.4,19.2 18.3,20.3 14.2,20.3 12.7,18.8 12.7,15.4 13.2,14.9 LAN.3 | R10.1 26.5,19.2
  Bottom 0.2: C25.1 LAN.3 15.3,14.9 15.2,14.8 15.3,14.8 15.4,14.9
S1A
  Top 0.2: IC9.4 17.73,43.83 18.2,44.3 18.2,49 19.23,50.03 UART_5V.4
S1B  (via drill 0.2)
  Top 0.2: v19,43.8 20.57,43.8 IC9.13
  Bottom 0.2: v19,43.8 18.5,44.3 18.5,47.6 17.23,48.87 UART_5V.6
S2A
  Top 0.2: IC9.5 13.03,43.17 11.8,44.4 11.8,47.2 12.8,48.2 15,48.2 16,49.2 16,50.8 16.5,51.3 18.5,51.3 UART_5V.3
S2B  (via drill 0.2)
  Top 0.2: 20.62,43.15 IC9.12 22.88,43.17 23.3,43.6 23.3,45.8 23,46.1 22.7,46.1 22.5,46.3 22.5,47.7 22,48.2 v19.5,48.2
  Bottom 0.2: UART_5V.5 17.73,52.57 18.5,51.8 18.5,49.2 v19.5,48.2
S3A
  Top 0.2: UART_3V.4 8.62,47.28 10.1,45.8 10.1,44.7 12.3,42.5 15.18,42.5 IC9.6
S3B  (via drill 0.2)
  Top 0.2: v18.5,42.5 20.57,42.5 IC9.11
  Bottom 0.2: v18.5,42.5 17.3,43.7 10.75,43.7 9.9,44.55 9.9,46.1 7.4,48.6 6.4,48.6 6.08,48.92 UART_3V.6
S4A
  Top 0.2: IC9.7 11.72,41.88 9.5,44.1 9.5,45.6 7.3,47.8 7.3,51 8.62,52.32 UART_3V.3
S4B  (via drill 0.2)
  Top 0.2: v17.85,41.9 20.57,41.9 IC9.10
  Bottom 0.2: v17.85,41.9 16.7,43.05 10,43.05 8.9,44.15 8.9,46.1 7.25,47.75 5.7,47.75 4.8,48.65 4.8,51.9 5.47,52.57 UART_3V.5
SCL  (via drill 0.2)
  Top 0.2: U1.28 19.39,60.66 v19.75,60.3
  Bottom 0.2: 19.75,61.85 20.1,62.2 20.1,66.7 20.7,67.3 23.4,67.3 24.15,66.55 24.15,63.05 24.75,62.45 31.95,62.45 32.95,63.45 32.95,66.7 34.05,67.8 36.55,67.8 38.75,65.6 42.95,65.6 43.25,65.3 44.1,65.3 45.3,64.1 45.3,62.85 45.65,62.5 52.25,62.5 53.6,63.85 I2C.2 | R27.2 v19.75,60.3 19.75,61.85 | 19,61.85 19.75,61.85
  Bottom 0.254: 19,61.85 IC6.4
SDA  (via drill 0.2)
  Top 0.2: U1.27 18.61,60.76 v18.15,60.3
  Bottom 0.2: R23.2 v18.15,60.3 17.5,60.95 17.5,63.45 17.9,63.85 IC6.5 19.4,63.85 19.4,66.8 20.4,67.8 23.85,67.8 24.75,66.9 24.75,63.25 25,63 31.8,63 32.4,63.6 32.4,67 33.85,68.45 36.95,68.45 39.3,66.1 43.2,66.1 43.5,65.8 44.5,65.8 45.9,64.4 45.9,63.2 46.05,63.05 51.8,63.05 52.3,63.55 52.3,64.35 54.34,66.39 I2C.1
T2_USBD+  (via drill 0.2)
  Top 0.2: IC2.8 41.7,7.75 43.4,7.75 44.1,7.05 44.85,7.05 45.2,6.7 v45.2,6 | v44.4,5.25 USB2.3
  Bottom 0.2: v45.2,6 v44.4,5.25
T2_USBD-  (via drill 0.2)
  Top 0.2: IC2.9 47.09,7.75 46.3,7.75 46.1,7.55 46.1,6 v46,5.8 | v43.75,5.75 USB2.2
  Bottom 0.2: v43.75,5.75 43.5,6 43.5,6.4 43.65,6.55 45.45,6.55 46,6 v46,5.8
TX3  (via drill 0.2)
  Top 0.2: IC5.38 25.25,47.05 24.55,47.75 24.55,53.45 23.2,54.8 14.6,54.8 14,55.4 14,59 12.45,60.55 v8.7,60.55
  Bottom 0.2: v8.7,60.55 8.7,57.93 UART_D.2
TX_ARD
  Top 0.2: Q4.2 33.15,57.85 33.15,57.2 32.95,57 R34.2 32.95,53.8 32.7,53.55 31.4,53.55 31.1,53.25 IC5.26
TX_D  (via drill 0.2)
  Top 0.2: 16.65,41.1 16.52,41.23 IC9.8 | 16.65,41.1 16.65,40.05 TX_4.TP | IC5.48 v24.55,42.05 | v17.3,41.1 16.65,41.1
  Bottom 0.2: v24.55,42.05 23.6,41.1 v17.3,41.1
TX_MCU  (via drill 0.2)
  Top 0.2: U1.31 21.81,61.04 22.8,60.05 Q5.3 v30.35,60.05
  Bottom 0.2: v30.35,60.05 31.2,60.05 31.5,60.35 R41.2 35.15,60.3 35.15,60.05
TX_T  (via drill 0.2)
  Top 0.2: IC2.1 41.66,12.2 40.75,12.2 40.65,12.3 40.65,13 40.7,13.05 v43.2,13.05 43.4,13.25 RX_1.TP | v55.15,15.25 55.35,15.45 56.75,15.45 57.7,16.4 57.7,41.4 55.9,43.2 50.65,43.2 48.95,44.9 48.95,45.6 48.6,45.95 46.95,47.6 45.5,47.6 44.3,48.8 40.4,48.8 38.85,50.35
  Top 0.254: IC5.17 35.6,52.45 35.9,52.75 38.45,52.75 38.85,52.35 38.85,50.35
  Bottom 0.2: v43.2,13.05 43.6,12.65 43.6,9.55 43.9,9.25 46.5,9.25 48.05,7.7 50.75,7.7 55.15,12.1 v55.15,15.25
TXN
  Top 0.2: IC1.56 35.7,18.4 34.9,17.6 18.5,17.6 17.9,17 LAN.2 19.36,14.7 R12.1
  Bottom 0.2: LAN.2 20.73,16.18 C26.1
TXP
  Top 0.2: IC1.55 35.2,18.7 34.7,18.2 16.11,18.2 LAN.1
  Bottom 0.2: C27.1 15.35,19.9 LAN.1 15.9,18 R13.1
USB0_D+  (via drill 0.2)
  Top 0.2: v30.55,8.75 30.55,13.55 33.1,16.1 35.2,16.1 36.95,17.85 36.95,19.15 37.2,19.4 IC1.59 | USB1.3 v28.9,6.25
  Bottom 0.2: v30.55,8.75 29.75,8.75 28.9,7.9 v28.9,6.25
USB0_D-  (via drill 0.2)
  Top 0.2: IC1.58 36.7,19.9 36.3,19.5 36.3,18 35.1,16.8 32.9,16.8 29.55,13.45 v29.55,9.95 | USB1.2 v28.25,5.45
  Bottom 0.2: v28.25,5.45 28.25,8.65 v29.55,9.95
USB1_D+
  Top 0.2: IC1.2 48.46,22.49 USB_PORTS.6
USB1_D-
  Top 0.2: IC1.1 45.06,21.99 46,21.05 46,20.4 46.5,19.9 48.45,19.9 USB_PORTS.4
USB2_D+
  Top 0.2: IC1.4 46.39,23.49 47.2,24.3 47.2,25.65 47.85,26.3 49.4,26.3 49.7,26 49.7,24.25 50.75,23.2 50.75,22.74 USB_PORTS.5
USB2_D-
  Top 0.2: IC1.3 47.09,22.99 47.9,23.8 49,23.8 49.7,23.1 49.7,21.25 USB_PORTS.3
USB3_D+
  Top 0.2: IC1.7 45.09,24.99 46.65,26.55 46.65,31.6 45.85,32.4 45.85,44.45 44.75,45.55 IC5.8
USB3_D-  (via drill 0.2)
  Top 0.2: IC1.6 40.55,24.5 45.4,24.5 47.1,26.2 47.1,31.95 46.45,32.6 v46.45,45 | v44.05,45.05 IC5.7
  Bottom 0.2: v46.45,45 44.1,45 v44.05,45.05
USB4_D+
  Top 0.2: IC1.9 44.49,25.99 45.65,27.15 45.65,30.85 44.8,31.7 44.8,33.5 44.35,33.95 21.55,33.95 19.85,32.25 12.8,32.25 11.75,33.3 USB_E.3
USB4_D-
  Top 0.2: IC1.8 44.8,25.5 46.15,26.85 46.15,31.2 45.3,32.05 45.3,33.8 44.4,34.7 21.55,34.7 19.65,32.8 13.15,32.8 12.7,33.25 12.7,34.45 11.85,35.3 USB_E.2
USB_PLL
  Top 0.2: IC1.62 38.7,19.5 39.2,19 41,19 41.4,18.6 41.4,18.59 R5.1 C19.1
VCCIO  (via drill 0.2, 0.5)
  Top 0.2: R42.1 v19.25,56.75 | v8.15,73.45 8.15,74 8.7,74.55 10.15,74.55 10.65,75.05 | 10.65,75.05 10.65,78.7 11.35,79.4 17.4,79.4 17.85,78.95 17.85,77.06 PIR.1 | C39.1 45.75,63.95 45.7,63.9 | C40.1 25.95,67.45 25.8,67.6 | 10.65,75.05 12,75.05 12.6,74.45 13.25,74.45 13.45,74.25 13.45,72.1 12.6,71.25 12.6,68.75 12.94,68.41 U1.18
  Top 0.254: U1.4 v22.41,65.99 v22.4,66 | R31.1 43.75,65 44.1,64.65 v44.1,63.9
  Top 0.406: U1.4 26.05,65.99 | SW1.2 SW1.5 44.4,63.75 44.25,63.9 v44.1,63.9 45.7,63.9 51.85,63.9 52.7,64.75 52.7,70.9 | 26.05,65.99 25.8,66.24 25.8,67.6 25.79,67.59 U1.6 17.65,67.6 16.84,68.41 U1.18 | 26.05,65.99 33.24,65.99 v33.95,66.7 | 55.2,76.96 SL6.1 54.8,76.56 54.8,75.65 52.7,73.55 52.7,70.9 | ICSP.2 52.59,70.79 52.7,70.9
  Bottom 0.2: v19.25,56.75 19.6,56.75 19.75,56.9 R27.1 | R39.2 v8.15,73.45 R37.1
  Bottom 0.254: R41.1 R40.1 37.7,61.55 38.25,62.1 38.25,64.9 38.2,65 | R23.1 R27.1 20.8,57.9 21.25,58.35 22.35,58.35 22.9,58.9 22.9,62 | IC6.3 22.85,61.95 22.9,62 | v22.4,66 23.1,66 23.5,65.6 23.5,62.6 22.9,62
  Bottom 0.406: v33.95,66.7 36.5,66.7 38.2,65 | v44.1,63.9 44.1,64.15 43.65,64.6 42.75,64.6 42.45,64.9 38.25,64.9
VPHY  (via drill 0.2)
  Top 0.2: v36.2,43.55 IC5.4
  Bottom 0.2: 34.8,43.55 v36.2,43.55 | C36.1 34.8,43.55 | 34.8,43.55 R20.1 34.7,41.95 C35.1
VPLL  (via drill 0.2)
  Top 0.2: IC5.9 36.1,46.05 35.95,46.2 v35.95,46.7
  Bottom 0.2: C32.1 34.6,48.5 R17.1 34.8,46.95 | 34.8,46.95 C30.1 | 34.8,46.95 35.7,46.95 v35.95,46.7
X0_ARD  (via drill 0.2)
  Top 0.2: U1.7 25.64,68.41 v25.7,68.55
  Bottom 0.2: 26.85,66.25 26.85,65.3 C31.1 | R18.1 30.3,66.65 29.9,66.25 26.85,66.25 | 26.85,66.25 27.05,66.45 XT2.1 26.55,67.7 v25.7,68.55
X1_ARD  (via drill 0.2)
  Top 0.2: U1.8 25.39,69.19 26.05,69.85 v30.3,69.85
  Bottom 0.2: XT2.3 28.6,69.85 v30.3,69.85 R18.2
  Bottom 0.254: C34.1 30.85,70.4 v30.3,69.85
YEL
  Top 0.2: LAN.Y2 4.1,17.15 5.6,18.65 5.6,23.25 7.2,24.85 R15.1

## Text on the board
tPlace: 13 | 12 | 11 | 7 | 6 | 5 | GND | VCC | 3.3v | 5V | 5V Vt GND